# EasyEDA Pro project easy_eda_proj.eprj, board PCB1_1
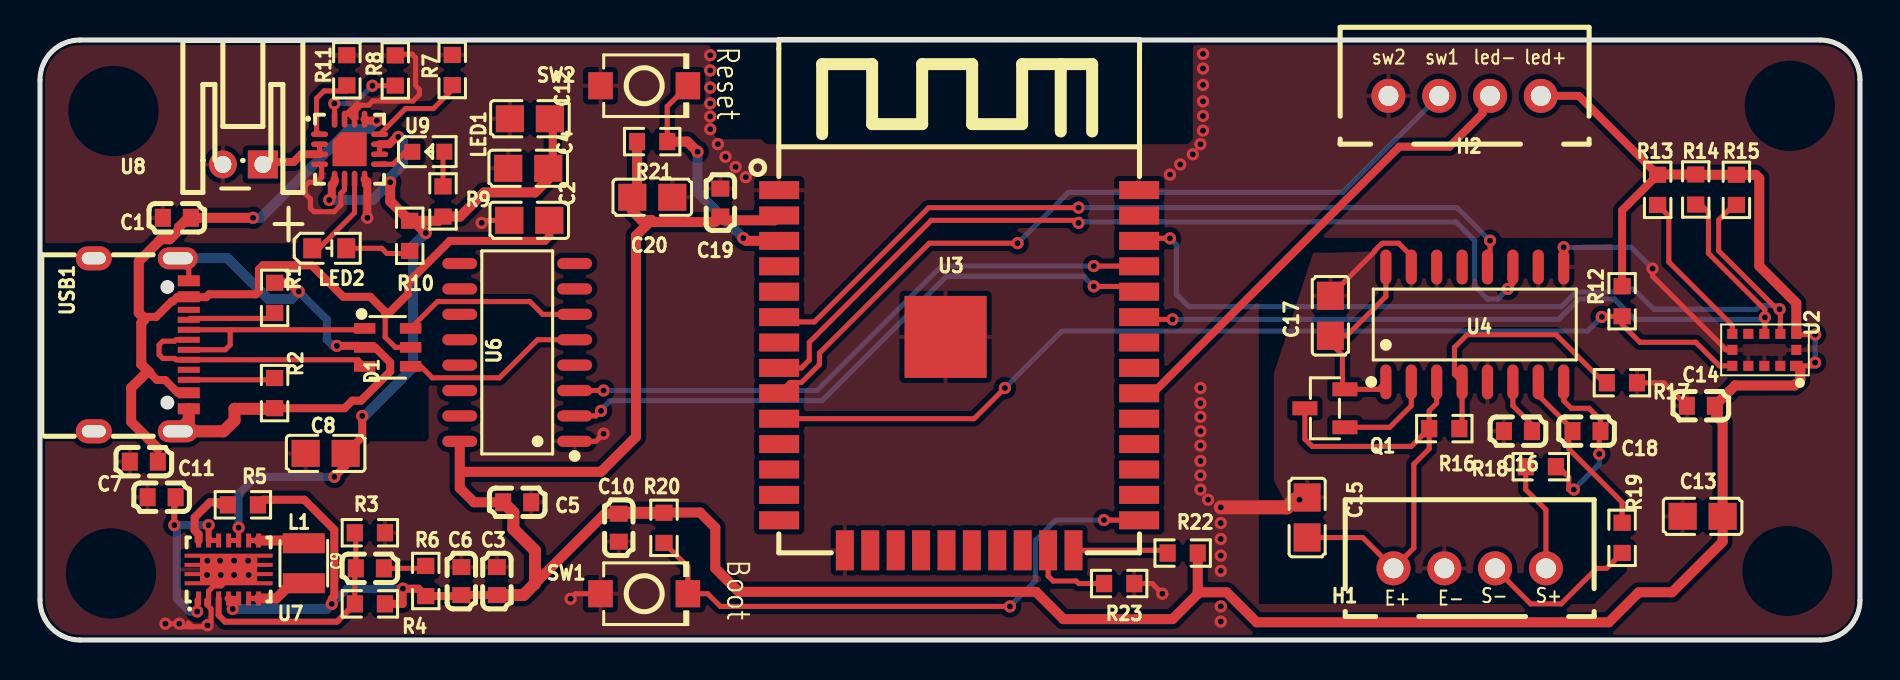
[diagram p1: board, top side]
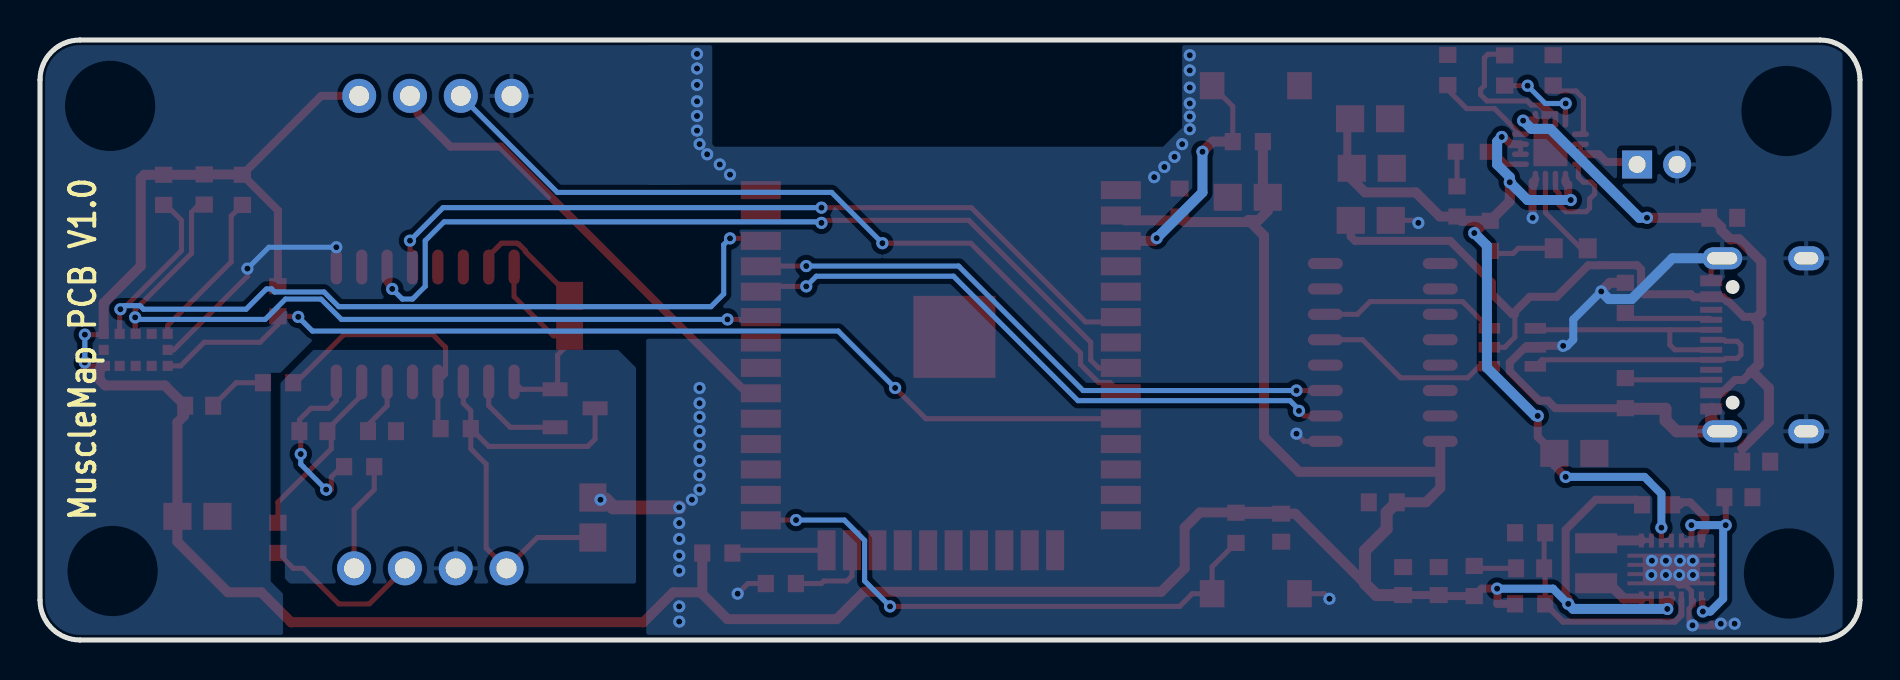
[diagram p2: board, bottom side, seen from below]

Outline 91 x 30 mm; copper layers: Top Layer, Bottom Layer. Coordinates in mm from the lower left corner of the outline.
Outline path: 0,28 0,2 arc(0.59,0.59) 2,0 89,0 arc(90.41,0.59) 91,2 91,28 arc(90.41,29.41) 89,30 2,30 arc(0.59,29.41) 0,28
Stack: Top Layer 0.035mm / Dielectric1 1.51mm FR4 er 4.5 / Bottom Layer 0.035mm

## Design rules (mm)
net D+_U: DP1
net D-_U: DP1
template: JLCPCB Capability(Two Layers Board)
spacing copperThickness1oz (default): track to track 0.102, other pairs 0.152 to 0.3
spacing copperThickness2oz: track to track 0.203, other pairs 0.152 to 0.3
track width copperThickness1oz (default): min 0.127, default 0.254, max 2.54
track width copperThickness2oz: min 0.203, default 0.254, max 2.54
differential pair differentialPair (default): width min 0.127, default 0.254, max 2.54; gap min 0.152, default 0.152
via viaSize (default): diameter min 0.5, default 0.61, max 10; hole min 0.3, default 0.305, max 6.3

## Placement (name value [footprint] x y rotation side)
C1  100nF  [C0603]  6.84 21.11 0 top
C2  10uF  [C0805]  24.46 20.98 0 top
C3  22uF  [C0603]  22.84 2.95 270 top
C4  10uF  [C0805]  24.41 23.59 180 top
C5  22uF  [C0603]  23.86 6.89 180 top
C6  22uF  [C0603]  21.07 2.95 270 top
C7  100nF  [C0603]  6.08 7.14 180 top
C8  10uF  [C0805]  14.28 9.33 180 top
C9  4.7pF  [C0603]  16.49 3.58 0 top
C10  100nF  [C0603]  28.94 5.62 270 top
C11  1uF  [C0603]  5.19 8.92 0 top
C12  4.7uF  [C0805]  24.5 26.06 0 top
C13  4.7uF  [C0805]  83.13 6.18 0 top
C14  100nF  [C0603]  83.04 11.71 0 top
C15  10uF  [C0805]  63.36 6.12 270 top
C16  100nF  [C0603]  73.9 10.44 180 top
C17  10uF  [C0805]  64.52 16.21 90 top
C18  100nF  [C0603]  77.33 10.44 0 top
C19  100nF  [C0603]  34.02 21.87 90 top
C20  10uF  [C0805]  30.61 22.14 0 top
D1  USBLC6-2SC6  [SOT-23-6_L2.9-W1.6-P0.95-LS2.8-BL]  17.38 14.63 270 top
H1  -  [CONN-TH_B4B-XH-A-LF-SN]  71.49 3.58 0 top
H2  -  [CONN-TH_B4B-XH-A-LF-SN]  71.23 27.21 0 top
L1  1.5uH  [IND-SMD_L2.5-W2.0_MEKK2520TR47M]  13.19 3.84 90 top
LED1  XL-1608SURC-06  [LED0603-RD_RED]  19.42 24.41 0 top
LED2  YLED0603B  [LED0603-FD]  14.46 19.59 180 top
Q1  BC807-40,215  [SOT-23-3_L2.9-W1.3-P1.90-LS2.4-BR]  64.25 11.58 0 top
R1  5.1kΩ  [R0603]  11.73 17.11 270 top
R2  5.1kΩ  [R0603]  11.73 12.34 90 top
R3  180kΩ  [R0603]  16.49 5.36 180 top
R4  1MΩ  [R0603]  16.49 1.81 0 top
R5  1MΩ  [R0603]  10.14 6.76 0 top
R6  68kΩ  [R0603]  19.29 2.95 270 top
R7  1.18kΩ  [R0603]  20.61 28.5 270 top
R8  1.13kΩ  [R0603]  17.76 28.48 270 top
R9  1kΩ  [R0603]  20.15 21.93 270 top
R10  1kΩ  [R0603]  18.49 20.21 90 top
R11  10kΩ  [R0603]  15.34 28.48 270 top
R12  3.6kΩ  [R0603]  79.1 16.94 90 top
R13  3.6kΩ  [R0603]  80.88 22.51 90 top
R14  3.6kΩ  [R0603]  82.79 22.52 90 top
R15  3.6kΩ  [R0603]  84.82 22.51 90 top
R16  20kΩ  [R0603]  70.22 10.57 180 top
R17  8.2kΩ  [R0603]  79.1 12.86 180 top
R18  100Ω  [R0603]  75.04 8.66 180 top
R19  100Ω  [R0603]  79.1 5.11 270 top
R20  10kΩ  [R0603]  31.2 5.61 90 top
R21  10kΩ  [R0603]  30.61 24.92 0 top
R22  10kΩ  [R0603]  57.13 4.35 0 top
R23  10kΩ  [R0603]  53.96 2.82 180 top
SW1  TS-1088-AR02016  [SW-SMD_L3.9-W3.0-P4.45]  30.21 2.31 0 top
SW2  TS-1088-AR02016  [SW-SMD_L3.9-W3.0-P4.45]  30.21 27.71 0 top
U2  VL53L4CDV0DH/1  [LGA-12_L4.4-W2.4_VL53L0X]  86.22 14.51 0 top
U3  ESP32-WROOM-32-N4  [WIFIM-SMD_ESP32-WROOM-32-N4]  45.96 13.49 0 top
U4  HX711  [SOP-16_L10.0-W3.9-P1.27-LS6.0-BL]  71.74 15.78 0 top
U6  CH340C  [SOP-16_L10.0-W3.9-P1.27-LS6.0-BL]  23.86 14.38 90 top
U7  TPS63020DSJT  [VSON-14_L4.0-W3.0-P0.50-BL-EP_TI_DSJ]  9.43 3.53 0 top
U8  S2B-PH-K-S(LF)(SN)  [CONN-TH_S2B-PH-K-S-LF-SN]  10.14 23.78 0 top
U9  BQ24075RGTR  [QFN-16_L3.0-W3.0-P0.50-TL-EP1.7]  15.48 24.54 0 top
USB1  TYPE-C 16PIN 2MD(073)  [USB-C-SMD_TYPE-C-6PIN-2MD-073]  5.06 14.76 270 top

## Footprints (pads in the part's own frame, mm; a bottom-side part is the same pattern mirrored in y, then rotated)
C0603
  rect 0.8x0.9 smd: 1(-0.7,0) 2(0.7,0)
C0805
  rect 1.41x1.35 smd: 1(-1,0) 2(1,0)
CONN-TH_B4B-XH-A-LF-SN
  round 1.7 hole 1: 1(-3.81,0) 2(-1.27,0) 3(1.27,0) 4(3.81,0)
CONN-TH_S2B-PH-K-S-LF-SN
  rect 1.5x1.4 hole 0.85: 1(1,0)
  round 1.4 hole 0.85: 2(-1,0)
IND-SMD_L2.5-W2.0_MEKK2520TR47M
  rect 1x2.1 smd: 1(1,0) 2(-1,0)
LED0603-FD
  rect 0.9x1 smd: 1(-0.85,0) 2(0.85,0)
LED0603-RD_RED
  rect 0.8x0.8 smd: 1(-0.799,-0.004) 2(0.799,0.004)
LGA-12_L4.4-W2.4_VL53L0X
  custom 0.635x0.508 smd: 1(1.6,-0.8)
  rect 0.508x0.508 smd: 2(0.8,-0.8) 3(0,-0.8) 4(-0.8,-0.8) 5(-1.6,-0.8) 6(-1.6,0) 7(-1.6,0.8) 8(-0.8,0.8) 9(0,0.8) 10(0.8,0.8) 11(1.6,0.8) 12(1.6,0)
QFN-16_L3.0-W3.0-P0.50-TL-EP1.7
  oval 0.85x0.28 smd: 1(-1.5,0.75) 2(-1.5,0.25) 3(-1.5,-0.25) 4(-1.5,-0.75) 9(1.5,-0.75) 10(1.5,-0.25) 11(1.5,0.25) 12(1.5,0.75)
  oval 0.28x0.85 smd: 5(-0.75,-1.5) 6(-0.25,-1.5) 7(0.25,-1.5) 8(0.75,-1.5) 13(0.75,1.5) 14(0.25,1.5) 15(-0.25,1.5) 16(-0.75,1.5)
  custom 1.7x1.7 smd: 17(0,0)
R0603
  rect 0.806x0.864 smd: 1(-0.753,0) 2(0.753,0)
SOP-16_L10.0-W3.9-P1.27-LS6.0-BL
  oval 0.56x1.745 smd: 1(-4.445,-2.873) 2(-3.175,-2.873) 3(-1.905,-2.873) 4(-0.635,-2.873) 5(0.635,-2.873) 6(1.905,-2.873) 7(3.175,-2.873) 8(4.445,-2.873) 9(4.445,2.873) 10(3.175,2.873) 11(1.905,2.873) 12(0.635,2.873) 13(-0.635,2.873) 14(-1.905,2.873) 15(-3.175,2.873) 16(-4.445,2.873)
SOT-23-3_L2.9-W1.3-P1.90-LS2.4-BR
  rect 1.25x0.7 smd: 1(1,-0.95) 2(1,0.95) 3(-1,0)
SOT-23-6_L2.9-W1.6-P0.95-LS2.8-BL
  rect 0.532x1.072 smd: 1(-0.95,-1.149) 2(0,-1.149) 3(0.95,-1.149) 4(0.95,1.149) 5(0,1.149) 6(-0.95,1.149)
SW-SMD_L3.9-W3.0-P4.45
  rect 1.23x1.36 smd: 1(-2.185,0) 2(2.185,0)
USB-C-SMD_TYPE-C-6PIN-2MD-073
  rect 0.55x1.1 smd: 1(-3.2,2.375) 2(-2.4,2.375) 11(2.4,2.375) 12(3.2,2.375)
  rect 0.3x1.1 smd: 3(-1.75,2.375) 4(-1.25,2.375) 5(-0.75,2.375) 6(-0.25,2.375) 7(0.25,2.375) 8(0.75,2.375) 9(1.25,2.375) 10(1.75,2.375)
  oval 1.1x2 hole 0.6x1.5: 13(-4.325,1.825) 14(4.325,1.825)
  oval 1.2x1.8 hole 0.6x1.2: 13(-4.325,-2.375) 14(4.325,-2.375)
VSON-14_L4.0-W3.0-P0.50-BL-EP_TI_DSJ
  rect 0.25x0.7 smd: 1(-1.5,-1.45) 2(-1,-1.45) 3(-0.5,-1.45) 4(0,-1.45) 5(0.5,-1.45) 6(1,-1.45) 7(1.5,-1.45) 8(1.5,1.45) 9(1,1.45) 10(0.5,1.45) 11(0,1.45) 12(-0.5,1.45) 13(-1,1.45) 14(-1.5,1.45)
  custom 4.4x1.58 smd: 15(0,0)
WIFIM-SMD_ESP32-WROOM-32-N4
  rect 2x0.9 smd: 1(-9,9.005) 2(-9,7.735) 3(-9,6.465) 4(-9,5.195) 5(-9,3.925) 6(-9,2.655) 7(-9,1.385) 8(-9,0.115) 9(-9,-1.155) 10(-9,-2.425) 11(-9,-3.695) 12(-9,-4.965) 13(-9,-6.235) 14(-9,-7.505) 25(9,-7.505) 26(9,-6.235) 27(9,-4.965) 28(9,-3.695) 29(9,-2.425) 30(9,-1.155) 31(9,0.115) 32(9,1.385) 33(9,2.655) 34(9,3.925) 35(9,5.195) 36(9,6.465) 37(9,7.735) 38(9,9.005)
  rect 0.9x2 smd: 15(-5.715,-9.005) 16(-4.445,-9.005) 17(-3.175,-9.005) 18(-1.905,-9.005) 19(-0.635,-9.005) 20(0.635,-9.005) 21(1.905,-9.005) 22(3.175,-9.005) 23(4.445,-9.005) 24(5.715,-9.005)
  rect 4.1x4.1 smd: 39(-0.68,1.665)

## Nets
3.3V: C3.2 C5.2 C6.2 C10.1 C13.2 C14.2 C19.1 C20.1 H2.4 R4.2 R5.2 R6.2 R12.2 R13.2 R14.2 R15.2 R20.2 R21.1 R22.2 U2.1 U2.11 U3.2 U6.16 U7.4 U7.5
GND: C1.1 C2.1 C3.1 C4.2 C5.1 C6.1 C7.2 C8.2 C10.2 C11.1 C12.1 C13.1 C14.1 C15.1 C16.2 C17.2 C19.2 C20.2 D1.2 H1.2 H2.1 R1.1 R2.1 R3.1 R7.1 R8.1 R11.1 R17.1 R23.1 SW1.1 SW2.1 U2.2 U2.3 U2.4 U2.6 U2.12 U3.1 U3.15 U3.38 U3.39 U4.5 U4.9 U4.10 U4.14 U4.15 U6.1 U7.2 U7.15 U8.2 U9.4 U9.6 U9.8 U9.14 U9.15 USB1.1 USB1.12 USB1.13 USB1.14
VBUS: C1.2 C2.2 C11.2 D1.5 U9.13 USB1.2 USB1.11
32: U3.8 U4.11
34: U3.6 U4.12
D+: D1.3 USB1.6 USB1.8
D+_U: D1.4 U6.5
D-: D1.1 USB1.5 USB1.7
D-_U: D1.6 U6.6
DSW: H2.2 U3.9
RX: U3.34 U6.2
SCL: R15.1 U2.10 U3.36
SDA: R14.1 U2.9 U3.33
TX: U3.35 U6.3
VOUT: C4.1 C8.1 C12.2 R9.2 R10.2 U7.10 U7.11 U9.5 U9.10 U9.11
XSHUT: R12.1 U2.5 U3.10
$1N1499: R1.2 USB1.4
$1N1538: R2.2 USB1.10
$1N2804: L1.1 U7.8 U7.9
$1N2809: L1.2 U7.6 U7.7
$1N2919: R5.1 U7.14
$1N3098: C7.1 U7.1 U7.12 U7.13
$1N3230: C9.1 R3.2 R4.1 U7.3
$1N3482: C9.2 R6.1
$1N4163: R7.2 U9.12
$1N4202: R8.2 U9.16
$1N4584: LED1.1 U9.9
$1N4586: LED1.2 R9.1
$1N4675: LED2.2 U9.7
$1N4721: LED2.1 R10.1
$1N4792: R11.2 U9.1
$1N4858: U8.1 U9.2 U9.3
$1N5175: R13.1 U2.7
$1N5467: C17.1 Q1.2 U4.1 U4.16
$1N5724: R16.1 R17.2 U4.4
$1N5741: Q1.1 U4.2
$1N5746: C15.2 H1.1 Q1.3 R16.2 U4.3
$1N5829: C16.1 U4.6
$1N6086: C18.2 R18.1 U4.8
$1N6088: C18.1 R19.1 U4.7
$1N6257: H1.4 R18.2
$1N6263: H1.3 R19.2
$1N6579: R20.1 SW1.2 U3.25
$1N6780: R21.2 SW2.2 U3.3
$1N6891: R22.1 U3.24
$1N6937: R23.2 U3.23
$1N12271: H2.3 U3.30

Pads without a net: U2 8; U3 4 5 7 11 12 13 14 16 17 18 19 20 21 22 26 27 28 29 31 32 37; U4 13; U6 4 7 8 9 10 11 12 13 14 15; U9 17; USB1 3 9

## Via types
v1: diameter 0.61, hole 0.305, Top Layer to Bottom Layer, 97 vias

## Routing (per net, layer and track width the routed paths; a pad name or vN(x,y) marks a point on that pad's centre or on a via; arc(x,y) is an arc through that point)
3.3V: length 181.3
  Top Layer w0.254: U2.11 87.85,15.27 v1(88.76,15.27) ; U2.1 88.59,13.71 v1(88.76,13.87) ; 16.97,1.81 R4.2 ; U7.5 U7.4
  Top Layer w0.4: C3.2 C6.2 21.02,2.2 R6.2 18.92,2.57 v1(18.14,2.57) 18.13,2.55 18.13,1.81 R4.2 ; U7.4 9.64,1.87 v1(9.64,1.55) ; R12.2 79.1,21.48 R13.2 76.94,27.21 H2.4 ; R5.2 11.15,7.01 13.22,7.01 14.72,5.51 14.72,2.19 14.59,2.06 v1(14.59,1.8)
  Top Layer w0.5: 57.99,2.41 57.89,2.41 R22.2 ; 57.99,2.41 56.63,1.04 51.16,1.04 49.8,2.41 34.94,2.41 33.77,3.58 33.77,5.62 33,6.38 31.22,6.38 31.2,6.36 ; 57.99,2.41 58.02,2.38 59.33,2.38 60.83,0.89 78.44,0.89 79.94,2.39 81.6,2.39 84.13,4.91 C13.2 84.13,10.88 83.8,11.2 83.8,11.65 C14.2 84.76,12.73 87.74,12.73 88.02,13 88.02,13.5 U2.1 ; U6.16 20.99,7.6 21.7,6.89 C5.2 ; 30.58,21 30.07,21 29.61,21.45 C20.1 29.85,22.38 R21.1 ; 30.58,21 30.68,20.9 33.75,20.9 C19.1 34.21,20.98 36.72,20.98 U3.2 ; 30.58,21 29.8,20.22 29.8,10.16 28.05,8.41 21.19,8.41 ; R13.2 80.9,23.28 R14.2 82.81,23.26 R15.2 85.78,23.26 85.96,23.08 85.96,18.7 87.82,16.84 U2.11 ; C10.1 28.24,6.32 24.75,2.82
  Top Layer w0.6: C10.1 28.98,6.36 31.2,6.36 ; C5.2 23.67,6.38 23.67,5.55 24.75,4.47 24.75,2.82 24.17,2.25 C3.2
  Bottom Layer w0.254: v1(88.76,13.87) v1(88.76,15.27)
  Bottom Layer w0.4: v1(18.14,2.57) 15.35,2.57 v1(14.59,1.8)
  Bottom Layer w0.5: v1(9.64,1.55) 14.34,1.55 v1(14.59,1.8)
GND: length 83.1
  Top Layer w0.254: v1(22.08,20.86) 22.21,20.98 C2.1 ; U7.15 9.43,3.08 9.06,2.7 8.69,2.7 8.43,2.44 U7.2 8.33,1.98 8.33,1.77 8.55,1.56 8.55,0.91 v1(8.37,0.73) 8.21,0.73 8.14,0.66 7.6,0.66 ; 7.41,0.86 7.6,0.66 ; 7.6,0.66 7.11,0.66 v1(6.96,0.81) v1(6.27,0.81) ; 84.62,14.51 84.31,14.51 80.63,18.19 v1(80.63,18.57) ; U9.6 15.22,23.03 15.22,22.51 15.05,22.33 15.05,21.76 14.7,21.41 13.7,21.41 13.52,21.59 13.52,22.05 13.27,22.31 13.27,22.71 13.45,22.89 13.83,22.89 14.08,23.14 14.08,23.69 U9.4 ; v1(76.18,19.64) U4.9 ; v1(28.18,10.31) 27.8,9.93 U6.1 ; 15.48,26.44 15.23,26.19 U9.15 ; 15.48,26.44 15.86,26.83 ; 15.48,26.44 15.48,26.29 U9.14 15.8,26.11 15.8,26.49 16.05,26.74 16.43,26.74 16.64,26.95 18.65,26.95 18.97,27.27 18.97,27.52 18.78,27.71 18.78,29.11 18.6,29.29 17.83,29.29 R8.1 ; SW1.1 26.78,2.31 v1(26.53,2.06) ; 6.89,19.08 7.44,18.53 USB1.1 ; C17.2 66.74,19.42 66.74,19.47 67.06,19.8 67.11,19.8 67.15,19.84 67.93,19.84 68.56,19.2 U4.15 ; C14.1 81.19,12.86 R17.1 ; R23.1 55.61,2.82 v1(56.12,2.31)
  Top Layer w0.4: v1(16.37,21.11) 16.37,22.9 U9.8 ; R2.1 15.23,11.59 15.61,11.97 16.05,11.97 17.51,13.43 17.51,13.87 16.75,14.63 D1.2 15.98,14.63 15.91,14.71 v1(14.84,14.71)
  Top Layer w0.5: R1.1 12.51,17.86 v1(12.94,17.43)
  Top Layer w0.6: R2.1 11.7,11.56 9.73,11.56 9.73,10.98 9.17,10.44 6.89,10.44 7.44,10.98 USB1.12
  Top Layer w0.7: v1(62.98,7.01) 62.72,7.01 62.34,6.63 v1(59.04,6.63)
  Bottom Layer w0.254: v1(80.63,18.57) 79.56,19.64 v1(76.18,19.64)
  Bottom Layer w0.4: v1(14.84,14.71) 14.64,14.71 14.34,15.01 14.34,16.03 v1(12.94,17.43)
  Bottom Layer w0.5: v1(12.94,17.43) 12.56,17.05 11.41,17.05 9.38,19.08 7.91,19.08
  vias: v1(8.37,3.97) v1(8.35,3.25) v1(9,3.97) v1(9.04,3.25) v1(9.7,3.97) v1(9.7,3.25) v1(10.41,3.97) v1(10.43,3.25) v1(33.51,29.24) v1(33.51,28.48) v1(33.51,27.62) v1(33.51,26.83) v1(33.51,26.17) v1(33.51,25.54) v1(33.89,24.79) v1(34.27,24.16) v1(34.78,23.65) v1(35.29,23.14) v1(56.5,23.27) v1(57.01,23.78) v1(57.64,24.28) v1(58.02,24.79) v1(58.02,12.6) v1(58.02,11.84) v1(58.02,11.16) v1(58.02,10.44) v1(58.02,9.72) v1(58.02,8.95) v1(58.02,8.23) v1(58.02,7.52) v1(58.15,29.31) v1(58.15,28.57) v1(58.15,27.75) v1(58.15,26.93) v1(58.15,26.2) v1(58.15,25.47) v1(58.4,7.01) v1(59.04,5.85) v1(59.04,5.05) v1(59.04,4.22) v1(59.04,3.46) v1(59.04,1.68) v1(59.04,0.92)
VBUS: length 57.8
  Top Layer w0.254: D1.5 17.76,14.63 17.26,15.14 17.26,16.28 ; C11.2 5.89,9.58
  Top Layer w0.4: C2.2 25.46,20.17 25.25,19.96 20.49,19.96 18.4,17.87 18.4,17.3 17.38,16.28 17.26,16.28 17.26,16.41 16.51,17.16 15.16,17.16 13.59,18.73 13.02,18.73 13.01,18.74 11.15,18.74 10.95,18.54 10.95,17.44 10.8,17.29 8.45,17.29 8.31,17.14 6.85,17.14 6.64,16.93 6.59,16.93 5.81,16.16 5.24,16.16 5.19,16.1 ; USB1.11 6.89,12.36 6.25,13 5.84,13 5.46,13.38 ; v1(16.84,25.97) 16.3,25.97 U9.13
  Top Layer w0.5: 5.89,9.58 4.56,10.91 4.56,12.6 5.34,13.38 5.46,13.38 5.06,13.78 5.06,15.85 5.19,15.98 5.19,16.1 4.94,16.36 4.94,18.93 6.05,20.04 6.49,20.04 6.94,20.49 6.94,20.64 7.42,21.11 C1.2 v1(10.65,21.11)
  Bottom Layer w0.5: v1(16.84,25.97) 16.43,25.55 15.48,25.55 11.03,21.11 v1(10.65,21.11)
32: length 44.4
  Top Layer w0.254: U4.11 73.64,17.81 v1(73.39,17.55) ; U3.8 38.07,13.6 38.47,14 38.47,14.89 44.56,20.98 51.8,20.98 v1(51.93,20.86)
  Bottom Layer w0.254: v1(51.93,20.86) 51.98,20.91 70.8,20.91 71.74,19.97 71.74,17.68 72.37,17.05 72.88,17.05 v1(73.39,17.55)
34: length 40.1
  Top Layer w0.254: v1(72.5,19.97) 72.5,18.78 U4.12 ; v1(51.93,21.62) 44.43,21.62 38.72,15.9 37.2,15.9 U3.6
  Bottom Layer w0.254: v1(72.5,19.97) 70.85,21.62 v1(51.93,21.62)
D+: length 12.6
  Top Layer w0.254: D1.3 15.91,14.01 USB1.8 6.8,14.01 6.73,14.08 6.14,14.08 5.95,14.27 5.95,14.75 6.14,14.94 6.73,14.94 6.8,15.01 USB1.6
D+_U: length 9.2
  Top Layer w0.254: D1.4 19.04,13.68 19.61,13.11 22.97,13.11 24.88,15.01 U6.5
D-: length 11.7
  Top Layer w0.254: D1.1 16.16,15.51 9.51,15.51 ; USB1.5 9.51,15.51 ; 9.51,15.51 9.51,14.76 9.26,14.51 USB1.7
D-_U: length 9
  Top Layer w0.254: U6.6 25.13,16.28 24.5,16.92 19.87,16.92 D1.6
DSW: length 39.5
  Top Layer w0.254: U3.9 37.5,12.88 38.07,12.88 38.97,13.78 38.97,14.35 44.46,19.84 v1(48.88,19.84)
  Bottom Layer w0.254: H2.2 65.13,22.38 51.42,22.38 v1(48.88,19.84)
RX: length 31.5
  Top Layer w0.254: v1(28.05,11.46) 27.8,11.2 U6.2 ; v1(52.69,17.68) 54.69,17.68 U3.34
  Bottom Layer w0.254: v1(52.69,17.68) 52.18,18.19 45.32,18.19 39.1,11.97 28.5,11.97 28.05,11.52 v1(28.05,11.46)
SCL: length 44.1
  Top Layer w0.254: 87.02,15.31 87.02,16.5 v1(86.98,16.54) 86.85,16.54 83.93,19.46 83.93,20.99 84.69,21.75 R15.1 ; v1(56.5,20.08) 55.09,20.08 U3.36
  Bottom Layer w0.254: v1(56.5,20.08) 56.82,19.77 56.82,17.3 57.45,16.66 76.06,16.66 76.8,17.4 79.27,17.4 79.42,17.55 79.68,17.55 80.69,16.54 85.82,16.54 86,16.72 86.8,16.72 v1(86.98,16.54)
SDA: length 40.3
  Top Layer w0.254: U2.9 86.24,15.33 v1(86.24,16.13) 86.24,16.51 83.42,19.33 83.42,21.39 83.04,21.77 R14.1 ; U3.33 55.07,16.03 v1(56.63,16.03)
  Bottom Layer w0.254: v1(56.63,16.03) 75.93,16.03 76.95,17.05 78.72,17.05 79.74,16.03 86.14,16.03 v1(86.24,16.13)
TX: length 30.8
  Top Layer w0.254: U3.35 54.95,18.7 v1(52.69,18.7) ; U6.3 v1(28.18,12.47)
  Bottom Layer w0.254: v1(28.18,12.47) 38.85,12.47 45.07,18.7 v1(52.69,18.7)
VOUT: length 45.1
  Top Layer w0.254: v1(9.93,5.62) U7.10 U7.11 ; U9.10 U9.11 ; 18.49,20.96 18.67,20.96
  Top Layer w0.4: v1(16.11,11.2) 16.11,10.16 C8.1 15.28,8.72 v1(14.72,8.16) ; v1(17.91,25.15) 17.85,25.09 17.75,25.09 17.46,24.79 U9.11 ; v1(14.46,22) 14.59,22.13 14.59,22.77 14.73,22.91 U9.5 ; C4.1 25.64,23.81 25.64,25.94 25.37,25.94
  Top Layer w0.5: v1(19.29,20.35) 18.67,20.96 19.94,20.96 R9.2 21,21.17 22.21,22.38 24.75,22.38 25.41,23.04 C4.1 ; v1(17.51,22.89) 17.51,21.94 18.49,20.96
  Bottom Layer w0.4: v1(14.72,8.16) 10.78,8.16 9.93,7.31 v1(9.93,5.62)
  Bottom Layer w0.5: v1(14.46,22) 16.62,22 v1(17.51,22.89) 17.51,23.14 18.14,23.78 18.14,24.92 v1(17.91,25.15) ; v1(16.11,11.2) 16.24,11.2 18.65,13.62 18.65,19.71 v1(19.29,20.35)
XSHUT: length 51
  Top Layer w0.254: v1(48.24,12.6) 46.71,11.06 U3.10 ; 84.62,13.71 83.97,13.71 82.79,14.89 79.99,14.89 79.1,15.78 R12.1 78.12,16.18 v1(78.09,16.16)
  Bottom Layer w0.254: v1(48.24,12.6) 51.09,15.45 77.38,15.45 v1(78.09,16.16)
$1N1499: length 4.4
  Top Layer w0.254: USB1.4 7.51,16.08 11.46,16.08 R1.2
$1N1538: length 4.3
  Top Layer w0.254: USB1.10 11.64,13.01 R2.2
$1N2804: length 2.8
  Top Layer w0.254: U7.9 U7.8
  Top Layer w0.5: L1.1 13.05,4.98 U7.8
$1N2809: length 3.1
  Top Layer w0.254: U7.6 U7.7
  Top Layer w0.5: U7.7 11.81,2.08 12.45,2.71 13.06,2.71 L1.2
$1N2919: length 3.3
  Top Layer w0.4: U7.14 7.93,5.29 7.73,5.49 7.73,6.12 8.49,6.89 8.88,6.89 9.01,6.76 R5.1
$1N3098: length 9.7
  Top Layer w0.254: U7.1 7.86,2 v1(7.86,1.42) ; U7.12 U7.13
  Top Layer w0.3: U7.13 v1(8.43,5.74) ; 6.78,6.76 6.72,6.69 v1(6.72,5.74)
  Bottom Layer w0.4: v1(8.43,5.74) v1(6.72,5.74) 6.84,5.62 6.84,2.06 7.48,1.42 v1(7.86,1.42)
$1N3230: length 11.7
  Top Layer w0.254: R3.2 15.79,5.31 C9.1 15.74,3.53 R4.1
  Top Layer w0.3: R4.1 14.85,0.92 9.25,0.92 8.93,1.24 U7.3
$1N3482: length 2.1
  Top Layer w0.254: R6.1 19.17,3.58 C9.2
$1N4163: length 4.8
  Top Layer w0.254: R7.2 20.61,27.51 19.67,26.57 18.27,26.57 16.99,25.29 U9.12
$1N4202: length 4.2
  Top Layer w0.254: U9.16 14.73,26.81 v1(14.72,26.83) ; v1(16.62,27.71) 17.76,27.71 R8.2
  Bottom Layer w0.254: v1(16.62,27.71) 15.73,26.83 v1(14.72,26.83)
$1N4584: length 1.9
  Top Layer w0.254: LED1.1 18.27,24.41 17.65,23.79 U9.9
$1N4586: length 1.8
  Top Layer w0.254: LED1.2 20.15,24.35 R9.1
$1N4675: length 4.5
  Top Layer w0.254: LED2.2 13.95,19.59 15.73,21.36 U9.7
$1N4721: length 3.3
  Top Layer w0.254: LED2.1 17.09,19.59 17.34,19.33 18.36,19.33 R10.1
$1N4792: length 3.8
  Top Layer w0.254: U9.1 13.97,25.29 13.83,25.43 13.83,27.08 14.2,27.45 15.34,27.45 R11.2
$1N4858: length 3.6
  Top Layer w0.254: U9.3 U9.2
  Top Layer w0.4: 11.02,23.9 12.68,23.9 13.07,24.29 U9.3
$1N5175: length 8
  Top Layer w0.254: R13.1 81.44,21.19 81.44,18.9 84.62,15.72 84.62,15.31
$1N5467: length 10.2
  Top Layer w0.254: U4.1 66.93,12.53 Q1.2 65.12,12.66 65.12,14.25 64.52,14.85 C17.1 65.33,15.21 67.29,17.17 U4.16
$1N5724: length 13.3
  Top Layer w0.254: R16.1 71.1,10.7 U4.4 70.72,13.28 70.72,14.63 71.36,15.27 75.8,15.27 78.22,12.85 78.22,12.61
$1N5741: length 5
  Top Layer w0.254: Q1.1 67.49,10.63 68.56,11.71 U4.2
$1N5746: length 23.4
  Top Layer w0.254: R16.2 69.46,9.56 68.69,8.79 68.69,4.6 H1.1 66.13,5.12 C15.2 ; R16.2 69.45,10.57 68.56,9.68 63.61,9.68 63.25,10.05 Q1.3 ; R16.2 69.46,11.47 69.83,11.84 U4.3
$1N5829: length 2.9
  Top Layer w0.254: U4.6 73.64,11.71 74.6,10.76 C16.1
$1N6086: length 9.2
  Top Layer w0.254: 75.79,8.79 76.44,8.15 76.44,7.52 v1(76.69,7.52) ; 78.03,10.65 77.96,10.58 v1(77.96,9.3) ; 78.03,10.65 78.03,11.01 77.45,11.58 76.56,11.58 76.18,11.97 U4.8 ; 78.03,10.65 78.03,10.44
  Bottom Layer w0.254: v1(76.69,7.52) 77.96,8.79 v1(77.96,9.3)
$1N6088: length 8.9
  Top Layer w0.254: U4.7 75.04,12.78 75.04,12.11 76.63,10.53 C18.1 76.44,10.25 76.44,9.55 79.1,6.89 R19.1
$1N6257: length 4.9
  Top Layer w0.254: 74.29,8.79 74.29,7.52 75.3,6.51 75.3,4.35
$1N6263: length 8.1
  Top Layer w0.254: H1.3 74.53,1.81 76.06,1.81 77.84,3.58 78.33,3.58 R19.2
$1N6579: length 28.8
  Top Layer w0.254: R20.1 32.4,3.66 SW1.2 33.38,2.31 34.02,1.68 v1(48.5,1.68) ; v1(53.2,6) 54.95,6 U3.25
  Bottom Layer w0.254: v1(53.2,6) 50.78,6 49.77,4.98 49.77,2.95 v1(48.5,1.68)
$1N6780: length 12.1
  Top Layer w0.254: R21.2 31.36,26.68 SW2.2
  Top Layer w0.5: v1(35.16,20.09) 35.3,19.95 U3.3 ; v1(32.88,24.41) 32.37,24.92 R21.2
  Bottom Layer w0.5: v1(32.88,24.41) 32.88,22.38 v1(35.16,20.09)
$1N6891: length 4.8
  Top Layer w0.254: U3.24 56.24,4.48 R22.1
$1N6937: length 4.2
  Top Layer w0.254: R23.2 51.94,2.82 51.81,2.95 50.66,2.95 50.4,3.2 U3.23
$1N12271: length 24
  Top Layer w0.4: U3.30 55.64,12.33 67.97,24.67 70.47,24.67 72.12,26.32 72.12,26.83 H2.3

## Copper pours and planes (outline as drawn; the poured copper is in the pictures)
GND on Top Layer: 64.57,19.36 80,19.84 79.61,11.08 79.61,4.6 78.34,3.33 64.1,3.33 61.7,7.97 61.7,13.32 63.66,19.36
GND on Top Layer: 86.34,21.49 86.34,1.93 84.82,-0.23 86.98,-1.5 95.62,-1.5 95.62,19.84 93.58,21.87 86.72,21.87
GND on Top Layer: 59.29,2.59 59.29,-2.89 90.41,-2.89 92.69,-0.61 92.69,5.36 92.82,5.49 81.39,5.49 77.71,1.81 60.08,1.81
GND on Top Layer: -1.03,30.51 -1.03,20.73 -0.14,19.84 18.62,19.84 19.44,19.03 19.44,10.08 19.29,9.93 -1.16,9.93 -2.05,9.05 -2.05,-2.26 -1.67,-2.64 60.94,-3.33 60.94,18.23 63.03,20.09 92.95,20.09 93.2,20.35 93.2,30.51 92.69,31.02 57.64,32.49 57.64,25.05 57.39,24.79 36.31,24.79 36.05,25.05 33.89,25.05 33.51,25.43 33.51,32.26 0.72,32.26
GND on Top Layer: 14.21,30.76 14.21,26.83 14.68,26.36 19.2,26.36 19.29,26.44 19.29,30.51 19.03,30.76
GND on Top Layer: 79.34,22.13 79.34,2.57 96.25,2.57 96.25,20.22 94.34,21.87
GND on Bottom Layer: 0.87,32.03 0.87,0.28 -0.52,-1.12 60.56,-1.12 60.69,-1.24 60.69,33.56 60.18,34.06 55.23,34.06 55.1,33.94 57.39,31.65 57.39,24.79 57.26,24.67 34.85,24.67 33.89,25.62 33.89,32.67 1.51,32.67
GND on Bottom Layer: 58.91,30.97 58.91,14.96 77.38,14.96 78.98,13.36 79.47,13.36 79.47,2.93 78.85,2.31 78.85,-1.24 79.1,-1.5 92.06,-1.5 92.69,-2.13 92.69,29.87 91.68,32.67
GND on Bottom Layer: 61.2,13.62 61.2,2.82 78.5,2.82 78.76,3.08 78.76,3.87 78.98,4.09 78.98,12.86 77.33,14.51 62.09,14.51

## Text on the board
Bottom Silkscreen Layer: MuscleMap PCB V1.0
Top Silkscreen Layer: sw2 | E+ | sw1 | E- | led- | S- | led+ | S+ | Reset | Boot | - | +
